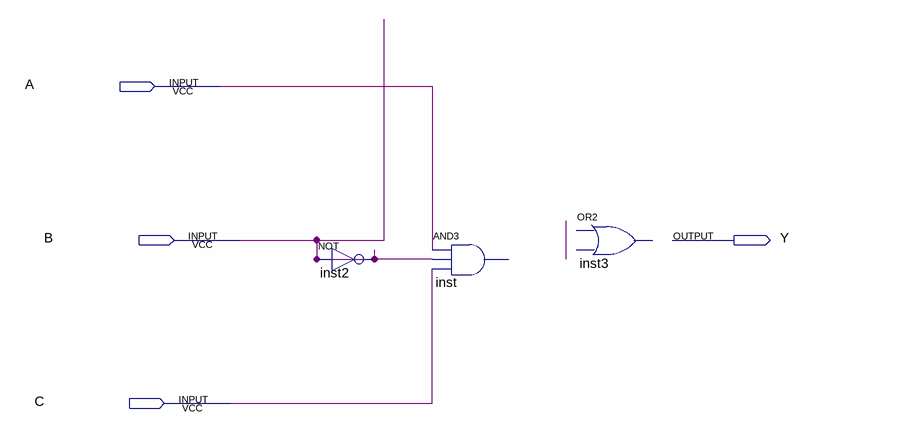
[diagram p0: schematic sheet]
// Quartus schematic kmap_demo.bdf as structural Verilog: 3 symbols, 4 pins
module kmap_demo (
  input  A,
  input  B,
  input  C,
  output Y
);

  wire inst2_out;

  not inst2 (inst2_out, B);
  // AND3 inst has open pins: IN1=A, IN2=inst2_out, IN3=C, OUT=open
  // OR2 inst3 is placed but not wired
endmodule
